# Altium schematic sheet NixieMicrocontroller.SchDoc
size A4
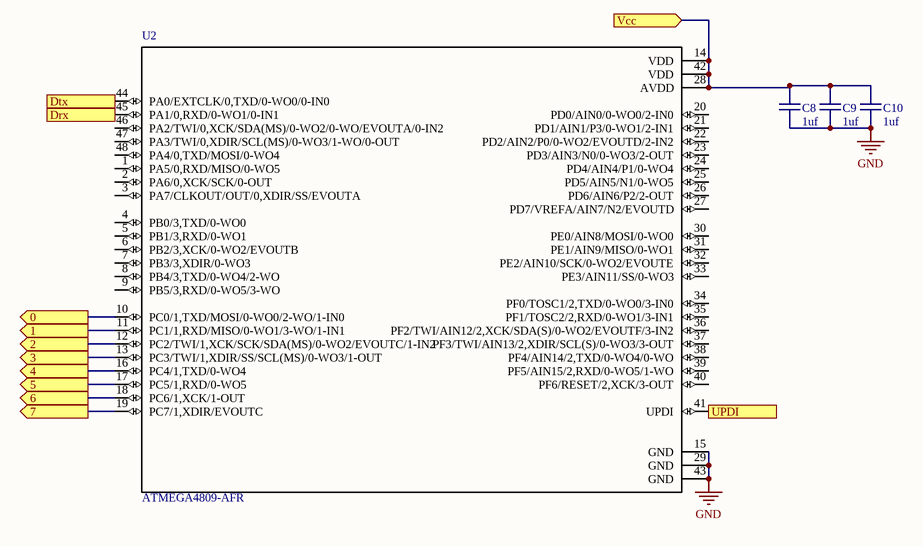
[diagram p0: NixieMicrocontroller.SchDoc]

## Parts
C8  1uf  [CAPC0805(2012)100_N]
C9  1uf  [CAPC0805(2012)100_N]
C10  1uf  [CAPC0805(2012)100_N]
U2  ATMEGA4809-AFR  [*QFP50P900X900X120-48N]

## Ports
0 (out), 1 (out), 2 (out), 3 (out), 4 (out), 5 (out), 6 (out), 7 (out), Drx (in), Dtx (out), UPDI, Vcc (in)

## Nets
GND: C8.1 C9.1 C10.1 U2.15(GND) U2.29(GND) U2.43(GND)
0: U2.10(PC0/1,TXD/MOSI/0-WO0/2-WO/1-IN0) ; port 0
1: U2.11(PC1/1,RXD/MISO/0-WO1/3-WO/1-IN1) ; port 1
2: U2.12(PC2/TWI/1,XCK/SCK/SDA(MS)/0-WO2/EVOUTC/1-IN2) ; port 2
3: U2.13(PC3/TWI/1,XDIR/SS/SCL(MS)/0-WO3/1-OUT) ; port 3
4: U2.16(PC4/1,TXD/0-WO4) ; port 4
5: U2.17(PC5/1,RXD/0-WO5) ; port 5
6: U2.18(PC6/1,XCK/1-OUT) ; port 6
7: U2.19(PC7/1,XDIR/EVOUTC) ; port 7
Drx: U2.45(PA1/0,RXD/0-WO1/0-IN1) ; port Drx
Dtx: U2.44(PA0/EXTCLK/0,TXD/0-WO0/0-IN0) ; port Dtx
UPDI: U2.41(UPDI) ; port UPDI
Vcc: C8.2 C9.2 C10.2 U2.14(VDD) U2.28(AVDD) U2.42(VDD) ; port Vcc

Not connected (* = marked no-connect by the designer): U2 1(PA5/0,RXD/MISO/0-WO5) 2(PA6/0,XCK/SCK/0-OUT) 3(PA7/CLKOUT/OUT/0,XDIR/SS/EVOUTA) 4(PB0/3,TXD/0-WO0) 5(PB1/3,RXD/0-WO1) 6(PB2/3,XCK/0-WO2/EVOUTB) 7(PB3/3,XDIR/0-WO3) 8(PB4/3,TXD/0-WO4/2-WO) 9(PB5/3,RXD/0-WO5/3-WO) 20(PD0/AIN0/0-WO0/2-IN0) 21(PD1/AIN1/P3/0-WO1/2-IN1) 22(PD2/AIN2/P0/0-WO2/EVOUTD/2-IN2) 23(PD3/AIN3/N0/0-WO3/2-OUT) 24(PD4/AIN4/P1/0-WO4) 25(PD5/AIN5/N1/0-WO5) 26(PD6/AIN6/P2/2-OUT) 27(PD7/VREFA/AIN7/N2/EVOUTD) 30(PE0/AIN8/MOSI/0-WO0) 31(PE1/AIN9/MISO/0-WO1) 32(PE2/AIN10/SCK/0-WO2/EVOUTE) 33(PE3/AIN11/SS/0-WO3) 34(PF0/TOSC1/2,TXD/0-WO0/3-IN0) 35(PF1/TOSC2/2,RXD/0-WO1/3-IN1) 36(PF2/TWI/AIN12/2,XCK/SDA(S)/0-WO2/EVOUTF/3-IN2) 37(PF3/TWI/AIN13/2,XDIR/SCL(S)/0-WO3/3-OUT) 38(PF4/AIN14/2,TXD/0-WO4/0-WO) 39(PF5/AIN15/2,RXD/0-WO5/1-WO) 40(PF6/RESET/2,XCK/3-OUT) 46(PA2/TWI/0,XCK/SDA(MS)/0-WO2/0-WO/EVOUTA/0-IN2) 47(PA3/TWI/0,XDIR/SCL(MS)/0-WO3/1-WO/0-OUT) 48(PA4/0,TXD/MOSI/0-WO4)

## Library data of the parts
C8-C10 = 2445: X7R 50V; id: 2445; rad: 1; rom: OV; lager_type: Fremlager; dybde: 4; hylle: 6; antall: 50; kolonne: 3; pakke_opprettet_av: 815; leverandor_varenr: 2408556; navn: 100nF; nokkelord: Kondensator, capacitor; produsent: Multikomp; leverandor: Farnell; pakketype: 0805; pakke_opprettet: 14.11.2014 20:52:01; symbol_opprettet_av: 815; symbol_opprettet: 14.11.2014 20:19:34; pris: 1
U2 = ATMEGA4809-AFR: 20MHz 48KB TQFP48 Ind 125C Green T&R; MF: Microchip; Package: TQFP-48 Microchip; Price: None; MP: ATMEGA4809-AFR; SnapEDA_Link: https://www.snapeda.com/parts/ATMEGA4809-AFR/Microchip/view-part/?ref=snap; Availability: Unavailable; Value: *